# EasyEDA schematic SCH_keeley 4 knob compressor_2022-01-26.json
TITLE: 4 Knob Compressor; REV: 1.0; Date: 2018-09-05; Sheet: 1/1; Drawn By: MaxiM
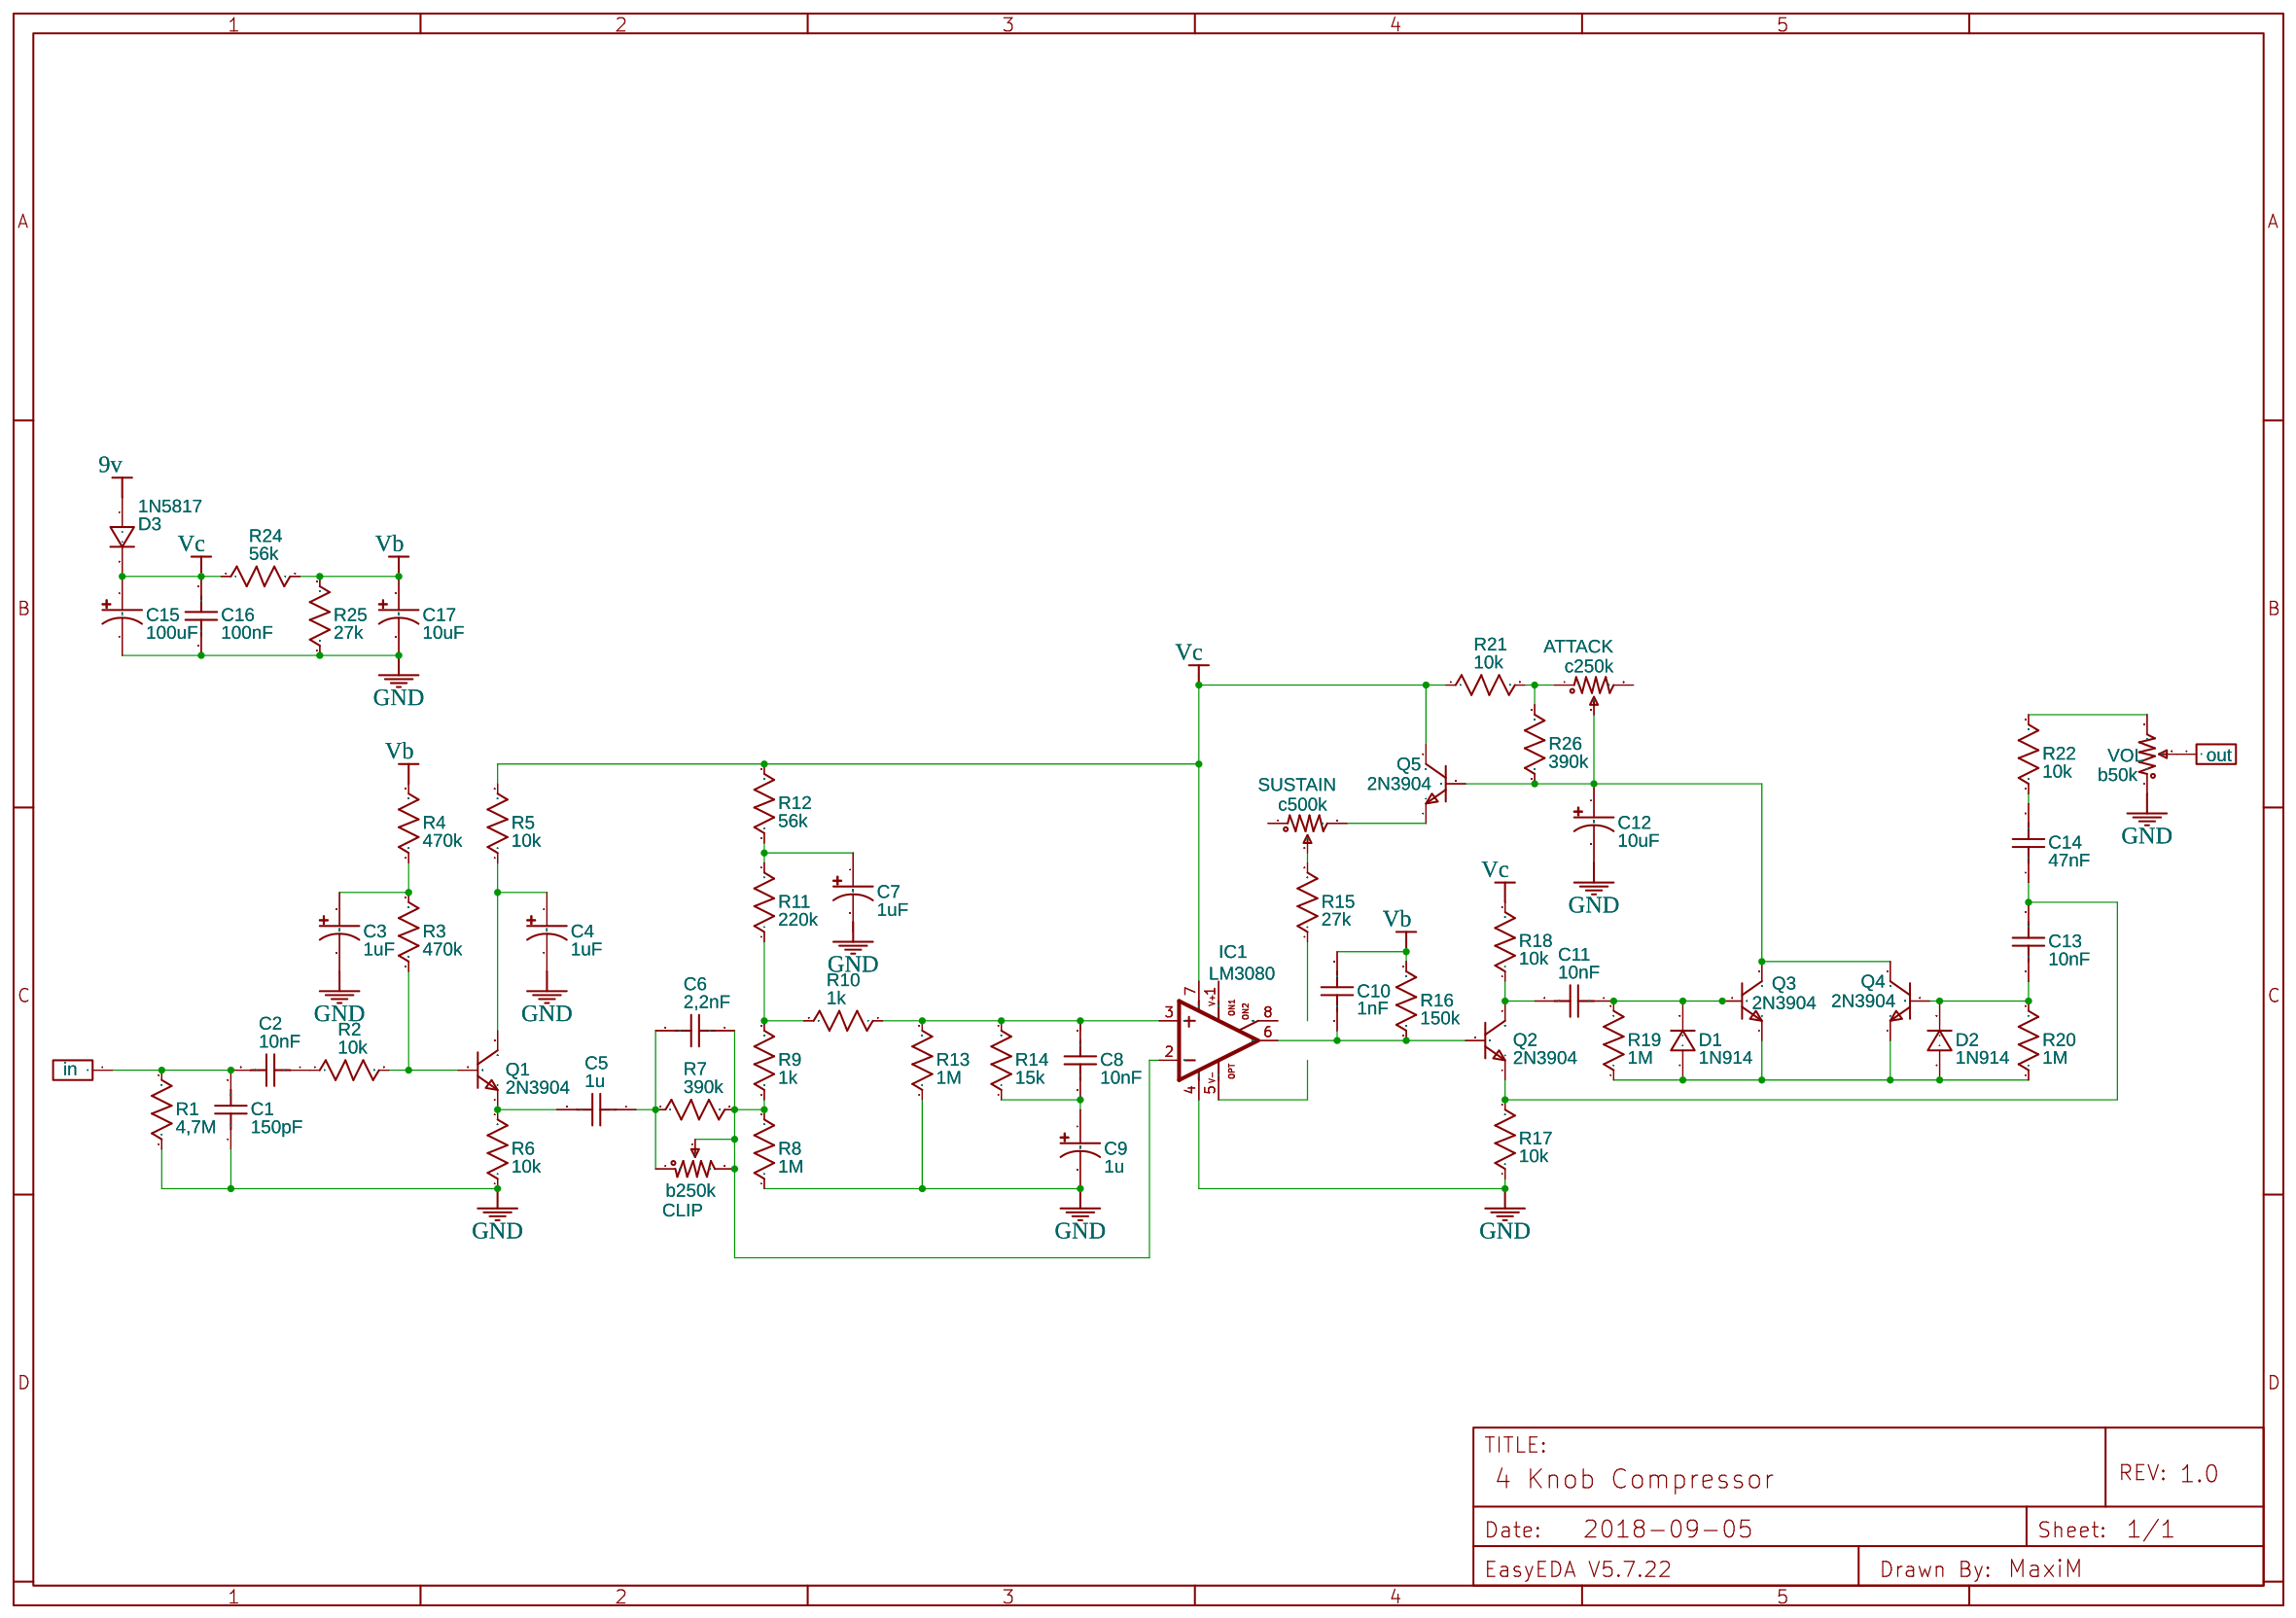
[diagram p0: schematic sheet]

## Parts
ATTACK  c250k  [RES-ADJ_3386P]
C1  150pF  [RAD-0.1]
C2  10nF  [RAD-0.1]
C3  1uF  [CAP-D3.0XF1.5]
C4  1uF  [CAP-D3.0XF1.5]
C5  1u  [RAD-0.1]
C6  2,2nF  [RAD-0.1]
C7  1uF  [CAP-D3.0XF1.5]
C8  10nF  [RAD-0.1]
C9  1u  [CAP-D3.0XF1.5]
C10  1nF  [RAD-0.1]
C11  10nF  [RAD-0.1]
C12  10uF  [CAP-D3.0XF1.5]
C13  10nF  [RAD-0.1]
C14  47nF  [RAD-0.1]
C15  100uF  [CAP-D3.0XF1.5]
C16  100nF  [RAD-0.1]
C17  10uF  [CAP-D3.0XF1.5]
CLIP  b250k  [RES-ADJ_3386P]
D1  1N914  [DO-35]
D2  1N914  [DO-35]
D3  1N5817  [DO-35]
IC1  LM3080  [DIL08]
P1  in  [HDR-1X1/2.54]
P2  out  [HDR-1X1/2.54]
Q1  2N3904  [TO-92(TO-92-3)]
Q2  2N3904  [TO-92(TO-92-3)]
Q3  2N3904  [TO-92(TO-92-3)]
Q4  2N3904  [TO-92(TO-92-3)]
Q5  2N3904  [TO-92(TO-92-3)]
R1  4,7M  [AXIAL-0.4]
R2  10k  [AXIAL-0.4]
R3  470k  [AXIAL-0.4]
R4  470k  [AXIAL-0.4]
R5  10k  [AXIAL-0.4]
R6  10k  [AXIAL-0.4]
R7  390k  [AXIAL-0.4]
R8  1M  [AXIAL-0.4]
R9  1k  [AXIAL-0.4]
R10  1k  [AXIAL-0.4]
R11  220k  [AXIAL-0.4]
R12  56k  [AXIAL-0.4]
R13  1M  [AXIAL-0.4]
R14  15k  [AXIAL-0.4]
R15  27k  [AXIAL-0.4]
R16  150k  [AXIAL-0.4]
R17  10k  [AXIAL-0.4]
R18  10k  [AXIAL-0.4]
R19  1M  [AXIAL-0.4]
R20  1M  [AXIAL-0.4]
R21  10k  [AXIAL-0.4]
R22  10k  [AXIAL-0.4]
R24  56k  [AXIAL-0.4]
R25  27k  [AXIAL-0.4]
R26  390k  [AXIAL-0.4]
SUSTAIN  c500k  [RES-ADJ_3386P]
VOL  b50k  [RES-ADJ_3386P]

## Library data of the parts
ATTACK CLIP SUSTAIN VOL = 3386P-1-101LF_US: Supplier Part: C125022; Supplier: LCSC; Manufacturer: Bochen; Manufacturer Part: 3386P-1-101LF; Contributor: EasyEDA
C1 C2 C5 C6 C8 C10 C11 C13 C14 C16 = Cap_RAD-0.1_US: Manufacturer Part: ?
C3 C4 C7 C9 C12 C15 C17 = Cap_Electrolytic(TH)_D3.0XF1.5_US: Manufacturer Part: ?
D1-D3 = -: Supplier Part: C54037; Supplier: LCSC; Manufacturer: SEMTECH; Manufacturer Part: 1N4448; image: //image.lceda.cn/szlcsc/C54037.jpg
IC1 = -: OP AMP; Manufacturer Part: ?
P1 P2 = -: Supplier Part: C81276; Supplier: LCSC; Manufacturer: ReliaPro; Manufacturer Part: Header-Male-2.54_1x1
Q1-Q5 = -: Supplier Part: C118538; Supplier: LCSC; Manufacturer: SEMTECH
R1-R22 R24-R26 = Res_AXIAL-0.4(1/4W)_US: Manufacturer Part: ?

## Nets
9v: D3.1(A)
GND: C1.1 C3.2 C4.2 C9.2 C12.2 C15.2 C16.1 C17.2 IC1.4(V-) R1.1 R6.1 R8.1 R13.1 R17.1 R25.1 VOL.1
Vb: C10.2 C17.1 R4.2 R16.2 R24.2 R25.2
Vc: C15.1 C16.2 D3.2(K) IC1.7(V+) Q5.3(C) R5.2 R12.2 R18.2 R21.1 R24.1
Net-(ATTACK-1): ATTACK.1 R21.2 R26.2
Net-(ATTACK-2): ATTACK.2 C12.1 Q3.3(C) Q4.3(C) Q5.2(B) R26.1
Net-(C1-2): C1.2 C2.2 P1.1 R1.2
Net-(C2-1): C2.1 R2.1
Net-(C3-1): C3.1 R3.2 R4.1
Net-(C4-1): C4.1 Q1.3(C) R5.1
Net-(C5-1): C5.1 C6.2 CLIP.1 R7.1
Net-(C5-2): C5.2 Q1.1(E) R6.2
Net-(C6-1): C6.1 CLIP.2 CLIP.3 IC1.2(-IN) R7.2 R8.2 R9.1
Net-(C7-1): C7.1 R11.2 R12.1
Net-(C8-1): C8.1 C9.1 R14.1
Net-(C8-2): C8.2 IC1.3(+IN) R10.1 R13.2 R14.2
Net-(C10-1): C10.1 IC1.6(OUT) Q2.2(B) R16.1
Net-(C11-1): C11.1 D1.2(K) Q3.2(B) R19.2
Net-(C11-2): C11.2 Q2.3(C) R18.1
Net-(C13-1): C13.1 D2.2(K) Q4.2(B) R20.2
Net-(C13-2): C13.2 C14.1 Q2.1(E) R17.2
Net-(C14-2): C14.2 R22.1
Net-(D1-1): D1.1(A) D2.1(A) Q3.1(E) Q4.1(E) R19.1 R20.1
Net-(P2-1): P2.1 VOL.2
Net-(Q1-2): Q1.2(B) R2.2 R3.1
Net-(Q5-1): Q5.1(E) SUSTAIN.3
Net-(R9-2): R9.2 R10.2 R11.1
Net-(R15-2): R15.2 SUSTAIN.2
Net-(R22-2): R22.2 VOL.3

Not connected (* = marked no-connect by the designer): ATTACK 3; C7 2; IC1 1(ON1) 5(OPT) 8(ON2); R15 1; SUSTAIN 1
